# Altium project BatteryHolder.PrjPcb
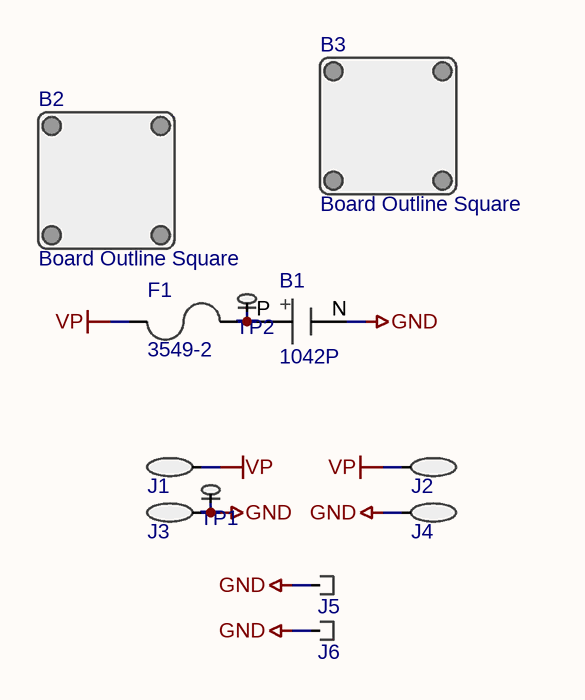
[diagram p0: BatteryHolder.SchDoc]
1 sheet, 12 parts. Net scope: global (net labels, ports and power ports of the same name join across sheets).
Board file: BatteryHolder.PcbDoc

## Sheet BatteryHolder.SchDoc
size A; SheetNumber: 1; SheetTotal: 1

### Parts
B1  1042P  [BATTERY_HOLDER_KEYSTONE_1042P]
B2  Board Outline Square  [PCB_OUTLINE_SQUARE]
B3  Board Outline Square  [PCB_OUTLINE_SQUARE]
F1  3549-2  [FUSE_HOLDER_KEYSTONE_3549-2]
J1  PP45  [CONNECTOR_BTOC_PP45_ANDERSON]  (value not drawn)
J2  PP45  [CONNECTOR_BTOC_PP45_ANDERSON]  (value not drawn)
J3  PP45  [CONNECTOR_BTOC_PP45_ANDERSON]  (value not drawn)
J4  PP45  [CONNECTOR_BTOC_PP45_ANDERSON]  (value not drawn)
J5  PP45 Staple  [CONNECTOR_ACCESSORY_PP45-STAPLE_ANDERSON]  (value not drawn)
J6  PP45 Staple  [CONNECTOR_ACCESSORY_PP45-STAPLE_ANDERSON]  (value not drawn)
TP1  519XTR  [TESTPOINT_LOOP_SMD_KEYSTONE_519X]  (value not drawn)
TP2  519XTR  [TESTPOINT_LOOP_SMD_KEYSTONE_519X]  (value not drawn)

### Nets
GND: B1.N J3.1 J4.1 J5.1 J6.1 TP1.1
VP: F1.2 J1.1 J2.1
NetB1_P: B1.P F1.1 TP2.1

### Notes on the sheet
- (in symbol Battery - Holder - Keystone 1042P) +

### Library data of the parts
B1 = Battery - Holder - Keystone 1042P: Supplier 1: Digi-Key; Supplier Part Number 1: 36-1042P-ND; Supplier 2: Mouser; Supplier Part Number 2: 534-1042P
B2 B3 = Board_Outline_Square
F1 = Fuse - Holder - Keystone 3549-2: Supplier 1: Digi-Key; Supplier Part Number 1: 36-3549-2-ND; Supplier 2: Mouser; Supplier Part Number 2: 534-3549-2
J1-J4 = Connector - Modular - 1P - Anderson PP45
J5 J6 = Connector - Accessory - Mechanical Support - Anderson PP45 Staple
TP1 TP2 = Test Point - SMT - Loop - Keystone 519X